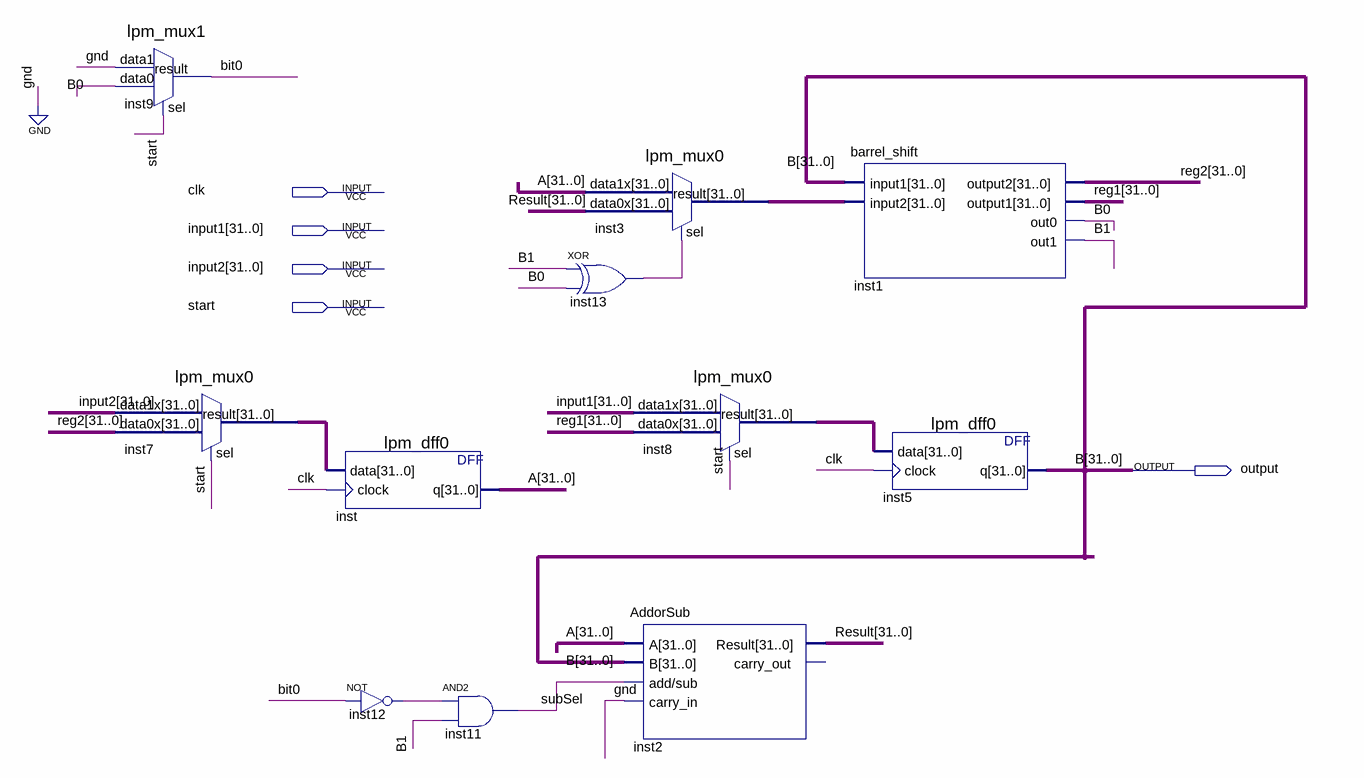
[diagram p0: schematic sheet]
// Quartus schematic multiplier.bdf as structural Verilog: 11 symbols, 5 pins
module multiplier (
  input  clk,
  input  [31:0] input1,
  input  [31:0] input2,
  input  start,
  output \output 
);

  wire bit0, inst12_out, inst13_out, subSel;
  wire [31:0] A, B, inst3_result, inst7_result, inst8_result, reg1, reg2, Result;

  lpm_mux1 inst9 (.data1(1'b0), .data0(B[0]), .sel(start), .result(bit0));
  lpm_mux0 inst7 (.data1x(input2), .data0x(reg2), .sel(start), .result(inst7_result));
  lpm_dff0 inst (.data(inst7_result), .clock(clk), .q(A));
  not inst12 (inst12_out, bit0);
  and inst11 (subSel, inst12_out, B[1]);
  xor inst13 (inst13_out, B[1], B[0]);
  lpm_mux0 inst3 (.data1x(A), .data0x(Result), .sel(inst13_out), .result(inst3_result));
  lpm_mux0 inst8 (.data1x(input1), .data0x(reg1), .sel(start), .result(inst8_result));
  AddorSub inst2 (.A(A), .B(B), .\add/sub (subSel), .carry_in(1'b0), .Result(Result));  // open: carry_out
  barrel_shift inst1 (.input1(B), .input2(inst3_result), .output2(reg2), .output1(reg1), .out0(B[0]), .out1(B[1]));
  lpm_dff0 inst5 (.data(inst8_result), .clock(clk), .q(B));
endmodule
